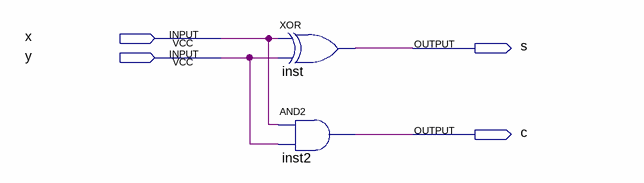
[diagram p0: schematic sheet]
// Quartus schematic MeioSomador.bdf as structural Verilog: 2 symbols, 4 pins
module MeioSomador (
  input  x,
  input  y,
  output s,
  output c
);

  xor inst (s, x, y);
  and inst2 (c, x, y);
endmodule
